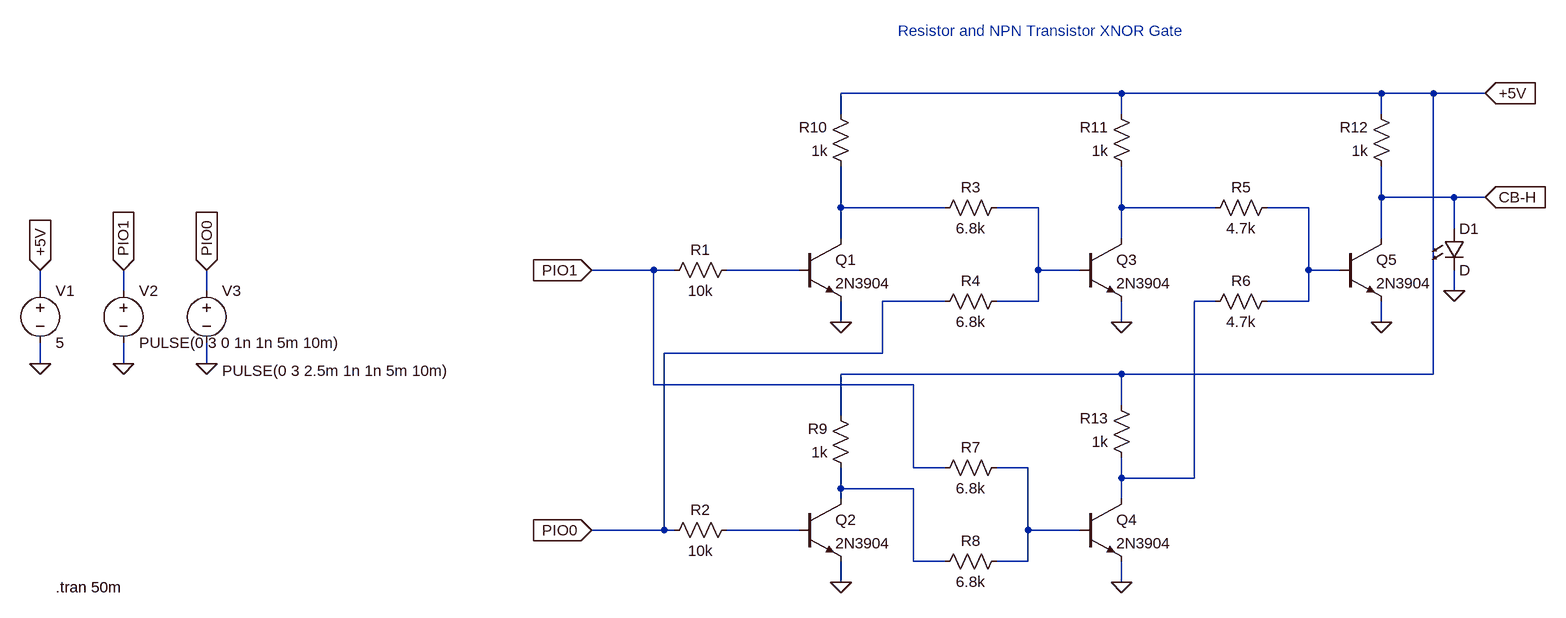
[diagram p0: schematic res_npn_xnor_gate_ltspice.asc]
res_npn_xnor_gate_ltspice.asc, the LTspice schematic file:
Version 4
SHEET 1 1240 680
WIRE 560 -192 128 -192
WIRE 960 -192 560 -192
WIRE 1040 -192 960 -192
WIRE 1120 -192 1040 -192
WIRE 128 -160 128 -192
WIRE 560 -160 560 -192
WIRE 960 -160 960 -192
WIRE 960 -32 960 -80
WIRE 1072 -32 960 -32
WIRE 1120 -32 1072 -32
WIRE 128 -16 128 -80
WIRE 288 -16 128 -16
WIRE 432 -16 368 -16
WIRE 560 -16 560 -80
WIRE 704 -16 560 -16
WIRE 848 -16 784 -16
WIRE 1072 16 1072 -32
WIRE 128 32 128 -16
WIRE 560 32 560 -16
WIRE 960 32 960 -32
WIRE -160 80 -256 80
WIRE -128 80 -160 80
WIRE 64 80 -48 80
WIRE 432 80 432 -16
WIRE 496 80 432 80
WIRE 848 80 848 -16
WIRE 896 80 848 80
WIRE -1104 112 -1104 80
WIRE -976 112 -976 80
WIRE -848 112 -848 80
WIRE 1072 112 1072 80
WIRE 288 128 192 128
WIRE 432 128 432 80
WIRE 432 128 368 128
WIRE 704 128 672 128
WIRE 848 128 848 80
WIRE 848 128 784 128
WIRE 128 160 128 128
WIRE 560 160 560 128
WIRE 960 160 960 128
WIRE 192 208 192 128
WIRE 192 208 -144 208
WIRE -1104 224 -1104 192
WIRE -976 224 -976 192
WIRE -848 224 -848 192
WIRE 560 240 128 240
WIRE 1040 240 1040 -192
WIRE 1040 240 560 240
WIRE -160 256 -160 80
WIRE 240 256 -160 256
WIRE 560 288 560 240
WIRE 128 304 128 240
WIRE 240 384 240 256
WIRE 288 384 240 384
WIRE 416 384 368 384
WIRE 560 400 560 368
WIRE 672 400 672 128
WIRE 672 400 560 400
WIRE 128 416 128 384
WIRE 240 416 128 416
WIRE 128 432 128 416
WIRE 560 432 560 400
WIRE -144 480 -144 208
WIRE -144 480 -256 480
WIRE -128 480 -144 480
WIRE 64 480 -48 480
WIRE 416 480 416 384
WIRE 496 480 416 480
WIRE 240 528 240 416
WIRE 288 528 240 528
WIRE 416 528 416 480
WIRE 416 528 368 528
WIRE 128 560 128 528
WIRE 560 560 560 528
FLAG 128 160 0
FLAG 560 160 0
FLAG 960 160 0
FLAG 1072 112 0
FLAG 128 560 0
FLAG 560 560 0
FLAG 1120 -192 +5V
IOPIN 1120 -192 In
FLAG 1120 -32 CB-H
IOPIN 1120 -32 In
FLAG -256 80 PIO1
IOPIN -256 80 In
FLAG -256 480 PIO0
IOPIN -256 480 In
FLAG -1104 224 0
FLAG -976 224 0
FLAG -1104 80 +5V
IOPIN -1104 80 In
FLAG -976 80 PIO1
IOPIN -976 80 In
FLAG -848 224 0
FLAG -848 80 PIO0
IOPIN -848 80 In
SYMBOL npn 64 32 R0
SYMATTR InstName Q1
SYMATTR Value 2N3904
SYMBOL npn 64 432 R0
SYMATTR InstName Q2
SYMATTR Value 2N3904
SYMBOL npn 496 32 R0
SYMATTR InstName Q3
SYMATTR Value 2N3904
SYMBOL npn 496 432 R0
SYMATTR InstName Q4
SYMATTR Value 2N3904
SYMBOL npn 896 32 R0
SYMATTR InstName Q5
SYMATTR Value 2N3904
SYMBOL res -32 64 R90
WINDOW 0 0 56 VBottom 2
WINDOW 3 32 56 VTop 2
SYMATTR InstName R1
SYMATTR Value 10k
SYMBOL res -32 464 R90
WINDOW 0 0 56 VBottom 2
WINDOW 3 32 56 VTop 2
SYMATTR InstName R2
SYMATTR Value 10k
SYMBOL res 384 -32 R90
WINDOW 0 0 56 VBottom 2
WINDOW 3 32 56 VTop 2
SYMATTR InstName R3
SYMATTR Value 6.8k
SYMBOL res 384 112 R90
WINDOW 0 0 56 VBottom 2
WINDOW 3 32 56 VTop 2
SYMATTR InstName R4
SYMATTR Value 6.8k
SYMBOL res 800 -32 R90
WINDOW 0 0 56 VBottom 2
WINDOW 3 32 56 VTop 2
SYMATTR InstName R5
SYMATTR Value 4.7k
SYMBOL res 800 112 R90
WINDOW 0 0 56 VBottom 2
WINDOW 3 32 56 VTop 2
SYMATTR InstName R6
SYMATTR Value 4.7k
SYMBOL res 384 368 R90
WINDOW 0 0 56 VBottom 2
WINDOW 3 32 56 VTop 2
SYMATTR InstName R7
SYMATTR Value 6.8k
SYMBOL res 384 512 R90
WINDOW 0 0 56 VBottom 2
WINDOW 3 32 56 VTop 2
SYMATTR InstName R8
SYMATTR Value 6.8k
SYMBOL res 144 400 R180
WINDOW 0 36 76 Left 2
WINDOW 3 36 40 Left 2
SYMATTR InstName R9
SYMATTR Value 1k
SYMBOL res 144 -64 R180
WINDOW 0 36 76 Left 2
WINDOW 3 36 40 Left 2
SYMATTR InstName R10
SYMATTR Value 1k
SYMBOL res 576 -64 R180
WINDOW 0 36 76 Left 2
WINDOW 3 36 40 Left 2
SYMATTR InstName R11
SYMATTR Value 1k
SYMBOL res 976 -64 R180
WINDOW 0 36 76 Left 2
WINDOW 3 36 40 Left 2
SYMATTR InstName R12
SYMATTR Value 1k
SYMBOL res 576 384 R180
WINDOW 0 36 76 Left 2
WINDOW 3 36 40 Left 2
SYMATTR InstName R13
SYMATTR Value 1k
SYMBOL LED 1056 16 R0
SYMATTR InstName D1
SYMBOL voltage -1104 96 R0
WINDOW 123 0 0 Left 0
WINDOW 39 0 0 Left 0
SYMATTR InstName V1
SYMATTR Value 5
SYMBOL voltage -976 96 R0
WINDOW 123 0 0 Left 0
WINDOW 39 0 0 Left 0
SYMATTR InstName V2
SYMATTR Value PULSE(0 3 0 1n 1n 5m 10m)
SYMBOL voltage -848 96 R0
WINDOW 3 24 139 Left 2
WINDOW 123 0 0 Left 0
WINDOW 39 0 0 Left 0
SYMATTR InstName V3
SYMATTR Value PULSE(0 3 2.5m 1n 1n 5m 10m)
TEXT 216 -288 Left 2 ;Resistor and NPN Transistor XNOR Gate
TEXT -1080 568 Left 2 !.tran 50m

The netlist it stands for:
* res_npn_xnor_gate_ltspice.asc
Q1 N001 N005 0 0 2N3904
Q2 N008 N009 0 0 2N3904
Q3 N003 N002 0 0 2N3904
Q4 N006 N007 0 0 2N3904
Q5 CB-H N004 0 0 2N3904
R1 N005 PIO1 10k
R2 N009 PIO0 10k
R3 N002 N001 6.8k
R4 N002 PIO0 6.8k
R5 N004 N003 4.7k
R6 N004 N006 4.7k
R7 N007 PIO1 6.8k
R8 N007 N008 6.8k
R9 N008 +5V 1k
R10 N001 +5V 1k
R11 N003 +5V 1k
R12 CB-H +5V 1k
R13 N006 +5V 1k
D1 CB-H 0 D
V1 +5V 0 5
V2 PIO1 0 PULSE(0 3 0 1n 1n 5m 10m)
V3 PIO0 0 PULSE(0 3 2.5m 1n 1n 5m 10m)
.model D D
.lib standard.dio
.model NPN NPN
.model PNP PNP
.lib standard.bjt
* Resistor and NPN Transistor XNOR Gate
.tran 50m
.backanno
.end